# Altium schematic sheet Sheet1.SchDoc
size 203 x 203 mm; SheetNumber: 1; SheetTotal: 1
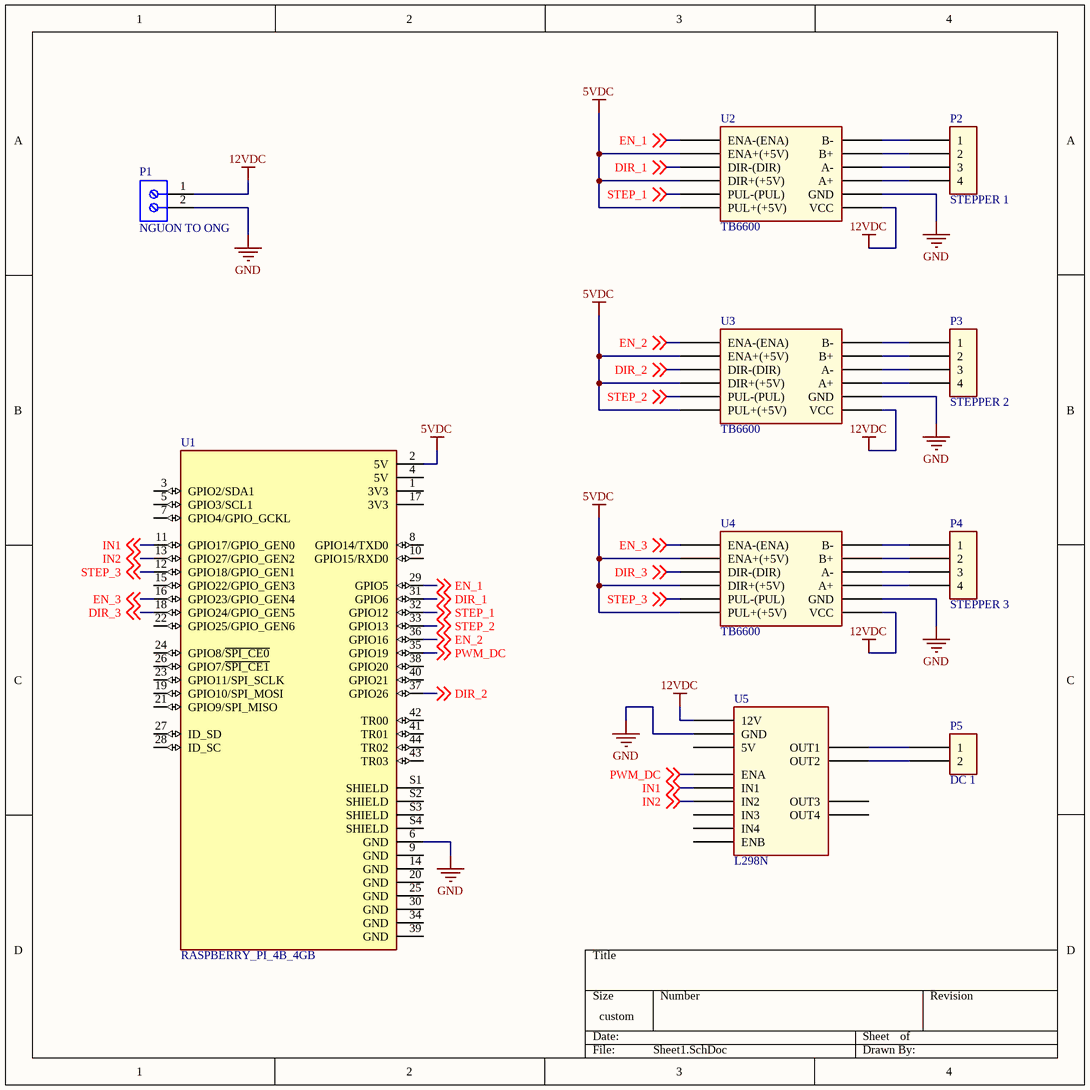
[diagram p0: Sheet1.SchDoc]

## Parts
P1  NGUON TO ONG  [DOMINO_2]
P2  STEPPER 1  [CON4]
P3  STEPPER 2  [CON4]
P4  STEPPER 3  [CON4]
P5  DC 1  [CON2]
U1  RASPBERRY_PI_4B_4GB  [MODULE_RASPBERRY_PI_4B_4GB]
U2  TB6600  [TB6600]
U3  TB6600  [TB6600]
U4  TB6600  [TB6600]
U5  L298N  [L298N]

## Nets
5VDC: U1.2(5V) U2.1(PUL+(+5V)) U3.1(PUL+(+5V)) U4.1(PUL+(+5V))
12VDC: P1.1 U2.1(VCC) U3.1(VCC) U4.1(VCC) U5.1(12V)
GND: P1.2 U1.6(GND) U2.1(GND) U3.1(GND) U4.1(GND) U5.1(GND)
DIR_1: U1.31(GPIO6) U2.1(DIR-(DIR)) ; off-sheet DIR_1
DIR_2: U1.37(GPIO26) U3.1(DIR-(DIR)) ; off-sheet DIR_2
DIR_3: U1.18(GPIO24/GPIO_GEN5) U4.1(DIR-(DIR)) ; off-sheet DIR_3
EN_1: U1.29(GPIO5) U2.1(ENA-(ENA)) ; off-sheet EN_1
EN_2: U1.36(GPIO16) U3.1(ENA-(ENA)) ; off-sheet EN_2
EN_3: U1.16(GPIO23/GPIO_GEN4) U4.1(ENA-(ENA)) ; off-sheet EN_3
IN1: U1.11(GPIO17/GPIO_GEN0) U5.1(IN1) ; off-sheet IN1
IN2: U1.13(GPIO27/GPIO_GEN2) U5.1(IN2) ; off-sheet IN2
PWM_DC: U1.35(GPIO19) U5.1(ENA) ; off-sheet PWM_DC
STEP_1: U1.32(GPIO12) U2.1(PUL-(PUL)) ; off-sheet STEP_1
STEP_2: U1.33(GPIO13) U3.1(PUL-(PUL)) ; off-sheet STEP_2
STEP_3: U1.12(GPIO18/GPIO_GEN1) U4.1(PUL-(PUL)) ; off-sheet STEP_3
NetP2_1: P2.1 U2.1(B-)
NetP2_2: P2.2 U2.1(B+)
NetP2_3: P2.3 U2.1(A-)
NetP2_4: P2.4 U2.1(A+)
NetP3_1: P3.1 U3.1(B-)
NetP3_2: P3.2 U3.1(B+)
NetP3_3: P3.3 U3.1(A-)
NetP3_4: P3.4 U3.1(A+)
NetP4_1: P4.1 U4.1(B-)
NetP4_2: P4.2 U4.1(B+)
NetP4_3: P4.3 U4.1(A-)
NetP4_4: P4.4 U4.1(A+)
NetP5_1: P5.1 U5.1(OUT1)
NetP5_2: P5.2 U5.1(OUT2)

Not connected (* = marked no-connect by the designer): U1 1(3V3) 3(GPIO2/SDA1) 4(5V) 5(GPIO3/SCL1) 7(GPIO4/GPIO_GCKL) 8(GPIO14/TXD0) 9(GND) 10(GPIO15/RXD0) 14(GND) 15(GPIO22/GPIO_GEN3) 17(3V3) 19(GPIO10/SPI_MOSI) 20(GND) 21(GPIO9/SPI_MISO) 22(GPIO25/GPIO_GEN6) 23(GPIO11/SPI_SCLK) 24(GPIO8/~{SPI_CE0}) 25(GND) 26(GPIO7/~{SPI_CE1}) 27(ID_SD) 28(ID_SC) 30(GND) 34(GND) 38(GPIO20) 39(GND) 40(GPIO21) 41(TR01) 42(TR00) 43(TR03) 44(TR02) S1(SHIELD) S2(SHIELD) S3(SHIELD) S4(SHIELD)

## Notes on the sheet
- Title:
- Size:
- Date:
- A4
- Draw By:
- Time:
- Revision:
- Sheet
- of
- File:

## Library data of the parts
P1 = DOMINO_2: Domino 2
P2-P4 = CON4: Connector 4
P5 = CON2: Connector 2
U1 = RASPBERRY_PI_4B_4GB: Raspberry Pi 4 Model B 4GB; MP: RASPBERRY PI 4B/4GB; Price: None; MF: Raspberry Pi; Check_prices: https://www.snapeda.com/parts/RASPBERRY%20PI%204B/4GB/Raspberry+Pi/view-part/?ref=eda; Value: *; Purchase-URL: https://pricing.snapeda.com/search/part/RASPBERRY PI 4B/4GB/?ref=eda; Availability: In Stock; SnapEDA_Link: https://www.snapeda.com/parts/RASPBERRY%20PI%204B/4GB/Raspberry+Pi/view-part/?ref=snap; Package: None
U2-U4 = TB6600: Driver Steppter TB6600